# EAGLE design brick_lcd (EAGLE 7.2.0)
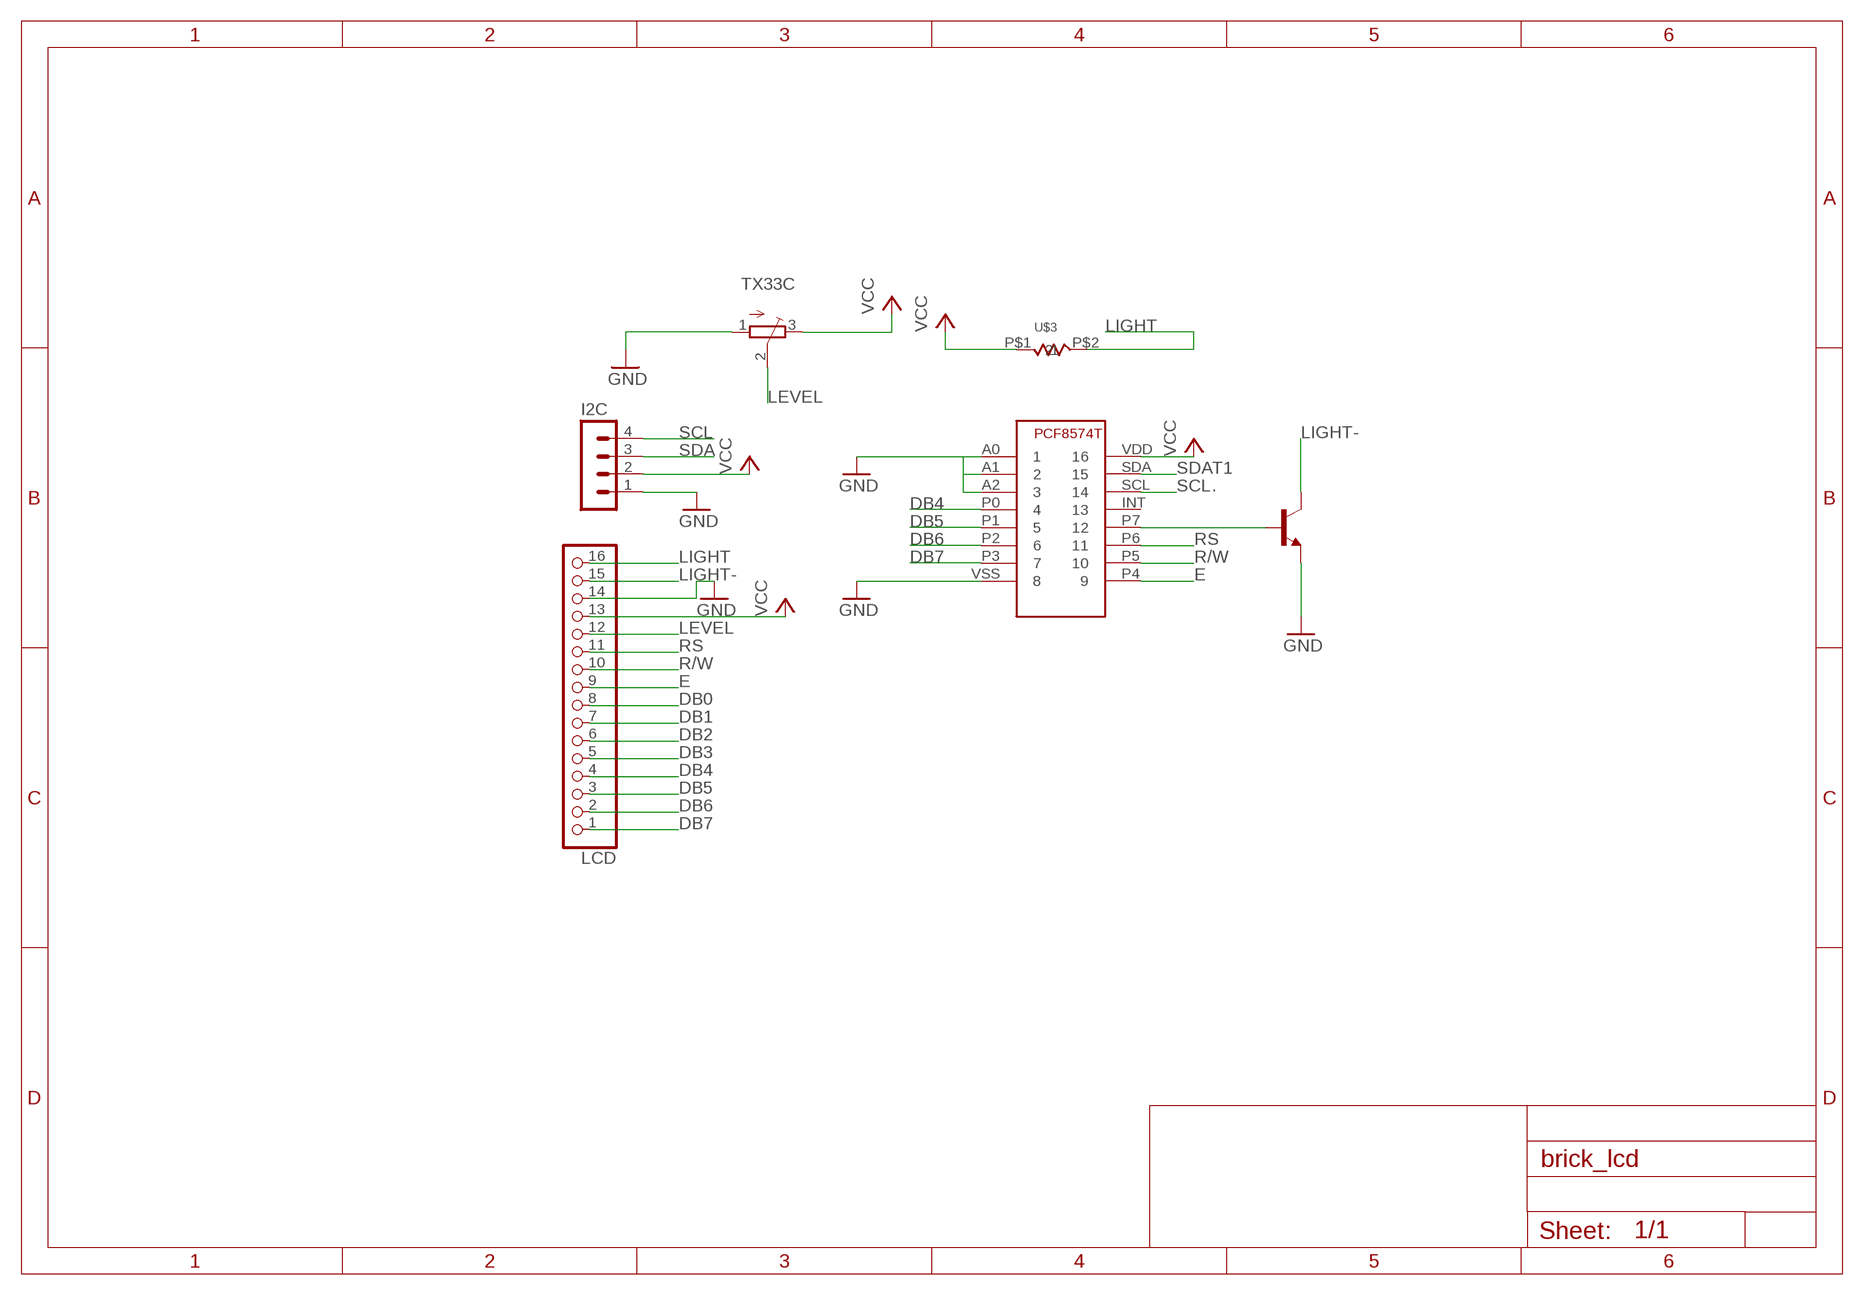
[diagram p0: schematic, sheet 1]

## Parts
I2C  MA04-1  [MA04-1]
LCD  PINHD-1X16  [1X16]
T1  .  BC850  [SOT23]
TX33C  TRIMPOTTC33X  [TC33X]
U$1  IC-PCF8574T  [SO16]
U$3  RESISTOR_0603  [RESISTOR_0603]

## Nets
DB0: LCD.8
DB1: LCD.7
DB2: LCD.6
DB3: LCD.5
DB4: LCD.4 U$1.P0
DB5: LCD.3 U$1.P1
DB6: LCD.2 U$1.P2
DB7: LCD.1 U$1.P3
E: LCD.9 U$1.P4
GND: I2C.1 LCD.14 T1.2(E) TX33C.1(A) U$1.A0 U$1.A1 U$1.A2 U$1.VSS
LEVEL: LCD.12 TX33C.2(S)
LIGHT: LCD.16 U$3.P$2
LIGHT-: LCD.15 T1.3(C)
N$6: T1.1(B) U$1.P7
R/W: LCD.10 U$1.P5
RS: LCD.11 U$1.P6
SCL: I2C.4 U$1.SCL
SDA: I2C.3 U$1.SDA
VCC: I2C.2 LCD.13 TX33C.3(E) U$1.VDD U$3.P$1
Unconnected: U$1.INT

## Library data of the parts
I2C = con-lstb:MA04-1: PIN HEADER; OC_FARNELL: unknown; OC_NEWARK: unknown
LCD = pinhead:PINHD-1X16: PIN HEADER
T1 = transistor:BC850: NPN TRANSISTOR
TX33C = adafruit:TRIMPOT: SMT trimmer potentiometer part number TC33X http://www.ladyada.net/library/eagle
U$1 = gclue:IC-PCF8574T
U$3 = gclue:RESISTOR_0603

## Board
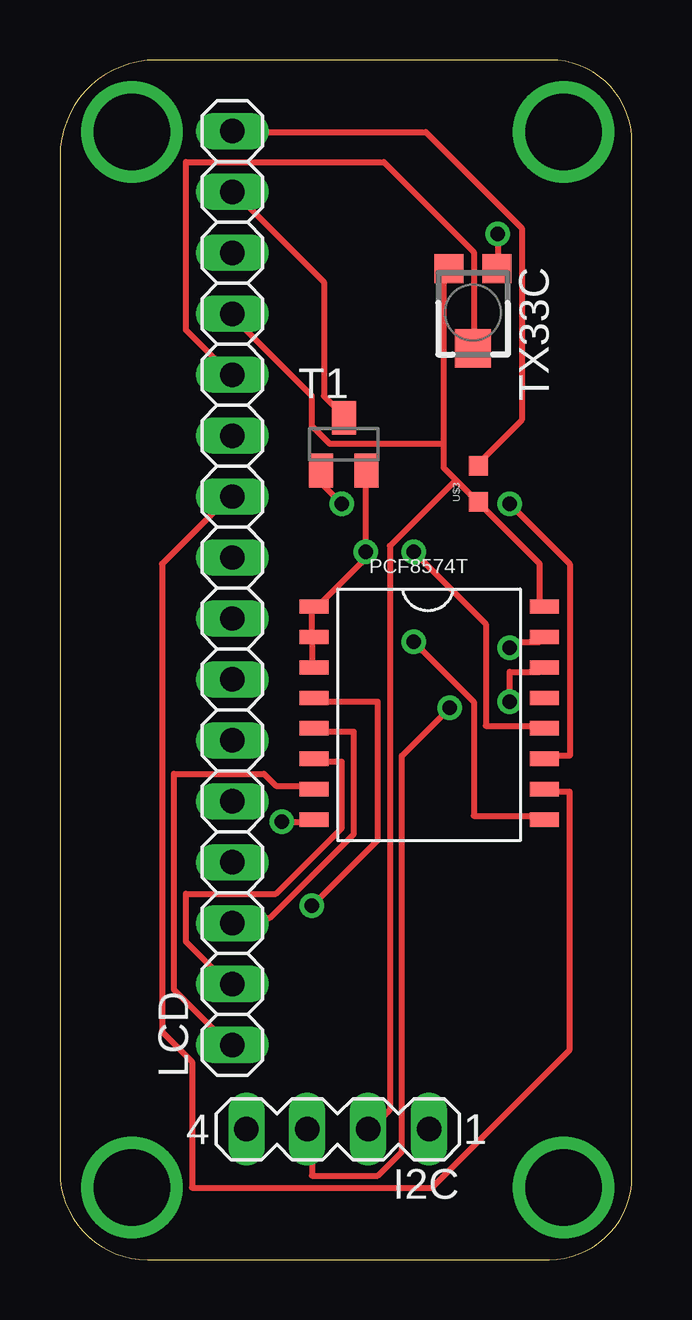
[diagram p1: board, top side]
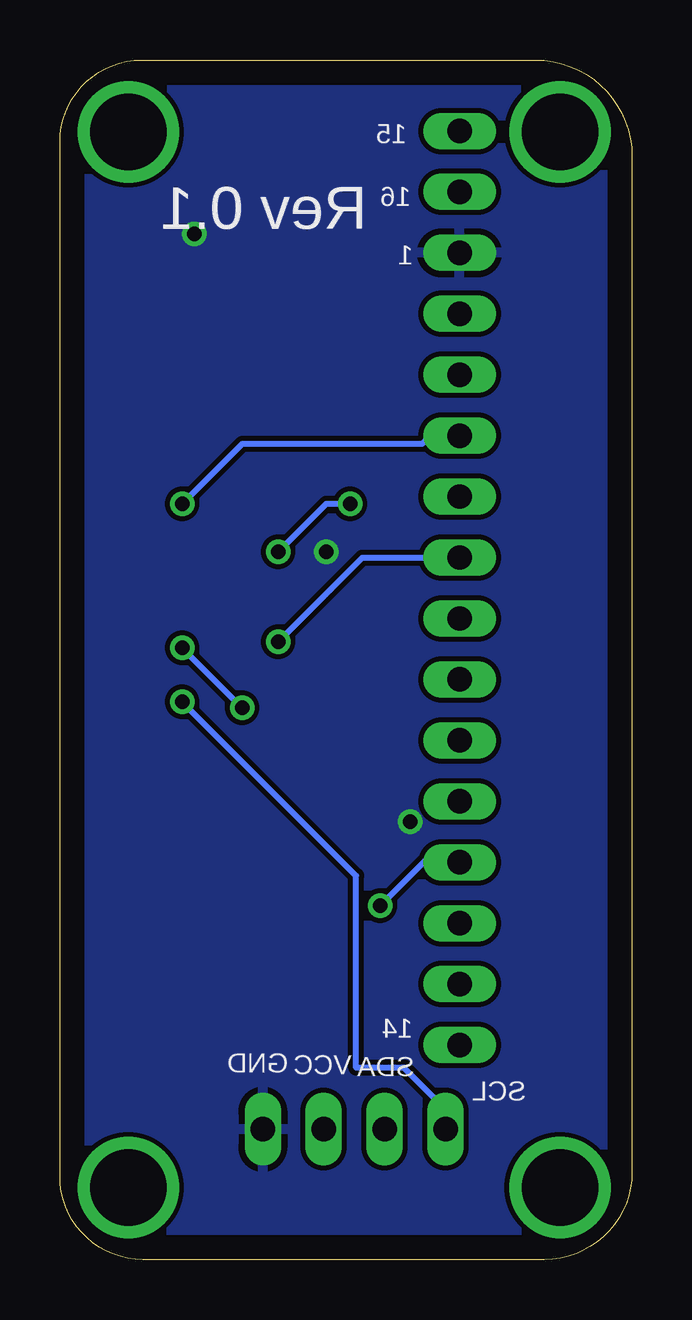
[diagram p2: board, bottom side, seen from below]

Size 23.85 x 50 mm. Coordinates in mm from the lower left corner, seen from the top.
Outline: 3.65,0 20.4,0 arc90 23.85,3.45 23.85,46.59 arc90 20.44,50 4.01,50 arc90 0,45.99 0,3.65 arc90 3.65,0
Copper layers (1*16): Top 0.035mm / dielectric 1.5mm / Bottom 0.035mm
Design rules "default": minimum track width 10mil, minimum drill 24mil, track to track 8mil, track to pad 8mil, pad to pad 8mil, via to via 8mil, smd to smd 8mil, copper to edge 40mil, drill to drill 8mil, minimum pad ring 10mil, minimum via ring 8mil, stop-mask expansion 4mil, vias tented up to drill 0mil, thermal gap 10mil

### Footprints (pad centres in the part's own frame; a part is rotated, then mirrored left to right if it is on the bottom)
MA04-1 = drill 1.016 long: 1 -3.81,0; 2 -1.27,0; 3 1.27,0; 4 3.81,0
1X16 = drill 1.016 long: 1 -19.05,0; 2 -16.51,0; 3 -13.97,0; 4 -11.43,0; 5 -8.89,0; 6 -6.35,0; 7 -3.81,0; 8 -1.27,0; 9 1.27,0; 10 3.81,0; 11 6.35,0; 12 8.89,0; 13 11.43,0; 14 13.97,0; 15 16.51,0; 16 19.05,0
SOT23 = smd 1 x 1.4: 1 -0.95,-1.1; 2 0.95,-1.1; 3 0,1.1
TC33X = smd 1.2 x 1.2: 1 -1,-1.825; 3 1,-1.825 | smd 1.5 x 1.6: 2 0,1.5
SO16 = smd 1.2 x 0.6: A0 -4.8,4.51; A1 -4.8,3.24; A2 -4.8,1.97; INT 4.8,0.7; P0 -4.8,0.7; P1 -4.8,-0.57; P2 -4.8,-1.84; P3 -4.8,-3.11; P4 4.8,-4.38; P5 4.8,-3.11; P6 4.8,-1.84; P7 4.8,-0.57; SCL 4.8,1.97; SDA 4.8,3.24; VDD 4.8,4.51; VSS -4.8,-4.38
RESISTOR_0603 = smd 0.8 x 0.8: P$1 -0.75,0; P$2 0.75,0

### Placement (x,y rotation side)
I2C  11.58,5.44 180 top
LCD  7.19,27.99 90 top
T1  11.84,33.99 0 top
TX33C  17.22,39.47 180 top
U$1  15.39,22.71 0 top
U$3  17.45,32.33 90 top

### Tracks (layer width: path | path; a pad name or v marks a point on that pad's centre or on a via)
DB4  (via drill 0.61)
  Top 0.254: v10.5,14.75 13.25,17.5 13.25,23.25 10.75,23.25 U$1.P0
  Bottom 0.254: v10.5,14.75 8.5,16.75 7.25,16.75 LCD.4
DB5
  Top 0.254: U$1.P1 10.75,22 12.25,22 12.25,17.75 8.75,14.25 7.25,14.25 LCD.3
DB6
  Top 0.254: U$1.P2 10.75,20.75 11.75,20.75 11.75,18 9,15.25 5.25,15.25 5.25,13.25 7,11.5 LCD.2
DB7
  Top 0.254: U$1.P3 10.5,19.75 9,19.75 8.5,20.25 4.75,20.25 4.75,11.25 7,9 LCD.1
E  (via drill 0.61)
  Top 0.254: v14.75,25.75 17.25,23.25 17.25,18.5 20,18.5 U$1.P4
  Bottom 0.254: v14.75,25.75 11.25,29.25 7.25,29.25 LCD.9
GND  (via drill 0.61)
  Top 0.254: U$1.A2 10.5,24.75 10.5,25.75 U$1.A1 10.5,26 10.5,27 U$1.A0 10.75,27.25 12.75,29.25 v12.75,29.5 12.75,32.75 T1.2 | v9.25,18.25 10.5,18.25 U$1.VSS | v18.25,42.75 18.25,41.5 TX33C.1
  pour Bottom: -1.27,50.29 24.92,50.29 24.92,-0.91 -1.6,-0.91 -1.6,49.94
LEVEL
  Top 0.254: TX33C.2 17.25,38 17.25,42 13.5,45.75 5.25,45.75 5.25,38.75 7,37 LCD.12
LIGHT
  Top 0.254: U$3.P$2 17.5,33.25 19.25,35 19.25,43 15.25,47 7.25,47 LCD.16
LIGHT-
  Top 0.254: T1.3 11.75,35.25 11,36 11,40.75 7.25,44.5 LCD.15
N$1  (via drill 3.2)
  other vias: 21,3
N$3  (via drill 3.2)
  other vias: 21,47
N$4  (via drill 3.2)
  other vias: 3,47
N$5  (via drill 3.2)
  other vias: 3,3
N$6  (via drill 0.61)
  Top 0.254: v14.75,29.5 17.75,26.5 17.75,22.25 20,22.25 U$1.P7 | v11.75,31.5 11,32.25 11,32.75 T1.1
  Bottom 0.254: v14.75,29.5 12.75,31.5 v11.75,31.5
R/W
  Top 0.254: U$1.P5 20.25,19.5 21.25,19.5 21.25,8.75 15.5,3 5.5,3 5.5,8.25 4.25,9.5 4.25,29 7,31.75 LCD.10
RS  (via drill 0.61)
  Top 0.254: v18.75,31.5 21.25,29 21.25,21 20.25,21 U$1.P6
  Bottom 0.254: v18.75,31.5 16.25,34 8.75,34 8.5,34.25 7.25,34.25 LCD.11
SCL  (via drill 0.61)
  Top 0.254: v18.75,23.25 18.75,24.5 20,24.5 U$1.SCL
  Bottom 0.254: v18.75,23.25 11.5,16 11.5,8 9.5,8 8,6.5 8,5.5 I2C.4
SDA  (via drill 0.61)
  Top 0.254: v18.75,25.5 18.75,25.75 20,25.75 U$1.SDA | v16.25,23 14.25,21 14.25,4.5 13.25,3.5 10.5,3.5 10.5,5.25 I2C.3
  Bottom 0.254: v16.25,23 v18.75,25.5
VCC
  Top 0.254: U$1.VDD 20,27.25 20,29 17.5,31.5 U$3.P$1 17.25,31.75 16.5,32.5 | 16,34 16,33 16.5,32.5 | 16,34 16,41.25 TX33C.3 | 16.5,32.5 13.75,29.75 13.75,6.25 13,5.5 I2C.2 | 16,34 11.25,34 10.5,34.75 10.5,36 7.25,39.25 LCD.13

### Text on the board
bPlace: 15 | 16 | Rev 0.1 | 1 | 14 | SDA | VCC | GND | SCL